# EAGLE design BSPD Breakout manufactured 2016-11-07 (EAGLE 7.6.0)
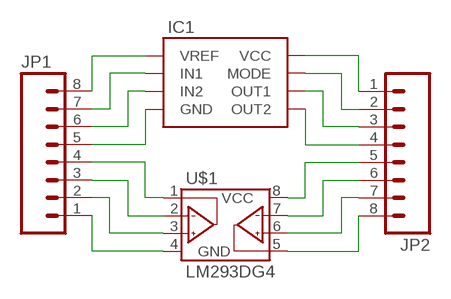
[diagram p0: schematic, sheet 1]

## Parts
IC1  MC34161DG  [SOIC-08]
JP1  M08  [1X08]
JP2  M08  [1X08]
U$1  LM293DG4  [SOIC-08]

## Nets
N$1: IC1.1(VREF) JP1.8
N$2: IC1.2(IN1) JP1.7
N$3: IC1.3(IN2) JP1.6
N$4: IC1.4(GND) JP1.5
N$5: IC1.5(OUT2) JP2.4
N$6: IC1.6(OUT1) JP2.3
N$7: IC1.7(MODE) JP2.2
N$8: IC1.8(VCC) JP2.1
N$9: JP2.5 U$1.8(VCC)
N$10: JP2.6 U$1.7(2OUT)
N$11: JP2.7 U$1.6(2IN-)
N$12: JP2.8 U$1.5(2IN+)
N$13: JP1.1 U$1.4(GND)
N$14: JP1.2 U$1.3(1IN+)
N$15: JP1.3 U$1.2(1IN-)
N$16: JP1.4 U$1.1(1OUT)

## Library data of the parts
IC1 = HyTechDevices:MC34161DG: On Semiconductor MC34161 Dual Channel Voltage Monitor
JP1 JP2 = HyTechDevices:M08: Standard 8-pin 0.1" header. NOTES ON THE VARIANTS LOCK and LOCK_LONGPADS... This footprint was designed to help hold the alignment of a through-hole component (i.e. 6-pin header) while soldering it into place. You may notice that each hole has been shifted either up or down by 0.005 of an inch from it's more standard position (which is a perfectly straight line). This slight alteration caused the pins (the squares in the middle) to touch the edges of the holes. Because they are alternating, it causes a "brace" to hold the component in place. 0.005 has proven to be the perfect amount of "off-center" position when using our standard breakaway headers. Although looks a little odd when you look at the bare footprint, once you have a header in there, the alteration is very hard to notice. Also,if you push a header all the way into place, it is covered up entirely on the bottom side. This idea of altering the position of holes to aid alignment will be further integrated into the Sparkfun Library for other footprints. It can help hold any component with 3 or more connection pins. Note: The Sparkfun version includes many other packages including surface mount that may be of future interest. Source: Sparkfun <https://github.com/sparkfun/SparkFun-Eagle-Libraries>
U$1 = HyTechDevices:LM293: Texas Instruments LM293 Dual Differential Comparator

## Board
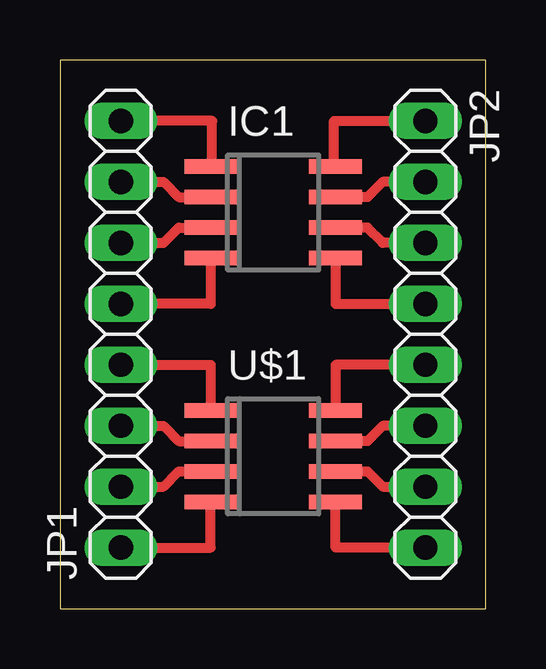
[diagram p1: board, top side]

Size 17.76 x 22.86 mm. Coordinates in mm from the lower left corner, seen from the top.
Outline: 0,0 17.76,0 17.76,22.86 0,22.86 0,0
Copper layers (1*16): Top 0.035mm / dielectric 1.5mm / Bottom 0.035mm
Design rules "default": minimum track width 10mil, minimum drill 24mil, track to track 8mil, track to pad 8mil, pad to pad 8mil, via to via 8mil, smd to smd 8mil, copper to edge 40mil, drill to drill 8mil, minimum pad ring 10mil, minimum via ring 8mil, stop-mask expansion 4mil, vias tented up to drill 0mil, thermal gap 10mil

### Footprints (pad centres in the part's own frame; a part is rotated, then mirrored left to right if it is on the bottom)
SOIC-08 = smd 0.6 x 2.2: 1 -1.905,-2.6; 2 -0.635,-2.6; 3 0.635,-2.6; 4 1.905,-2.6; 5 1.905,2.6; 6 0.635,2.6; 7 -0.635,2.6; 8 -1.905,2.6
1X08 = drill 1.016 long: 1 -8.89,0; 2 -6.35,0; 3 -3.81,0; 4 -1.27,0; 5 1.27,0; 6 3.81,0; 7 6.35,0; 8 8.89,0

### Placement (x,y rotation side)
IC1  8.89,16.51 270 top
JP1  2.54,11.43 90 top
JP2  15.24,11.43 270 top
U$1  8.89,6.35 270 top

### Tracks (layer width: path | path; a pad name or v marks a point on that pad's centre or on a via)
N$1
  Top 0.406: IC1.1 6.35,18.41 6.35,20.32 JP1.8
N$2
  Top 0.406: JP1.7 4.32,17.78 4.95,17.14 IC1.2
N$3
  Top 0.406: JP1.6 4.32,15.24 4.95,15.88 IC1.3
N$4
  Top 0.406: IC1.4 6.29,12.7 JP1.5
N$5
  Top 0.406: IC1.5 11.49,12.7 JP2.4
N$6
  Top 0.406: JP2.3 13.46,15.24 12.83,15.88 IC1.6
N$7
  Top 0.406: JP2.2 13.46,17.78 12.83,17.14 IC1.7
N$8
  Top 0.406: IC1.8 11.43,18.41 11.43,20.32 JP2.1
N$9
  Top 0.406: JP2.5 11.49,10.16 U$1.8
N$10
  Top 0.406: JP2.6 13.46,7.62 12.83,6.99 U$1.7
N$11
  Top 0.406: U$1.6 12.83,5.71 13.46,5.08 JP2.7
N$12
  Top 0.406: JP2.8 11.49,2.54 U$1.5
N$13
  Top 0.406: JP1.1 6.29,2.54 U$1.4
N$14
  Top 0.406: JP1.2 4.32,5.08 4.95,5.71 U$1.3
N$15
  Top 0.406: JP1.3 4.32,7.62 4.95,6.99 U$1.2
N$16
  Top 0.406: JP1.4 6.29,10.16 U$1.1